# EAGLE board bmsEC2 (EAGLE 4.13)
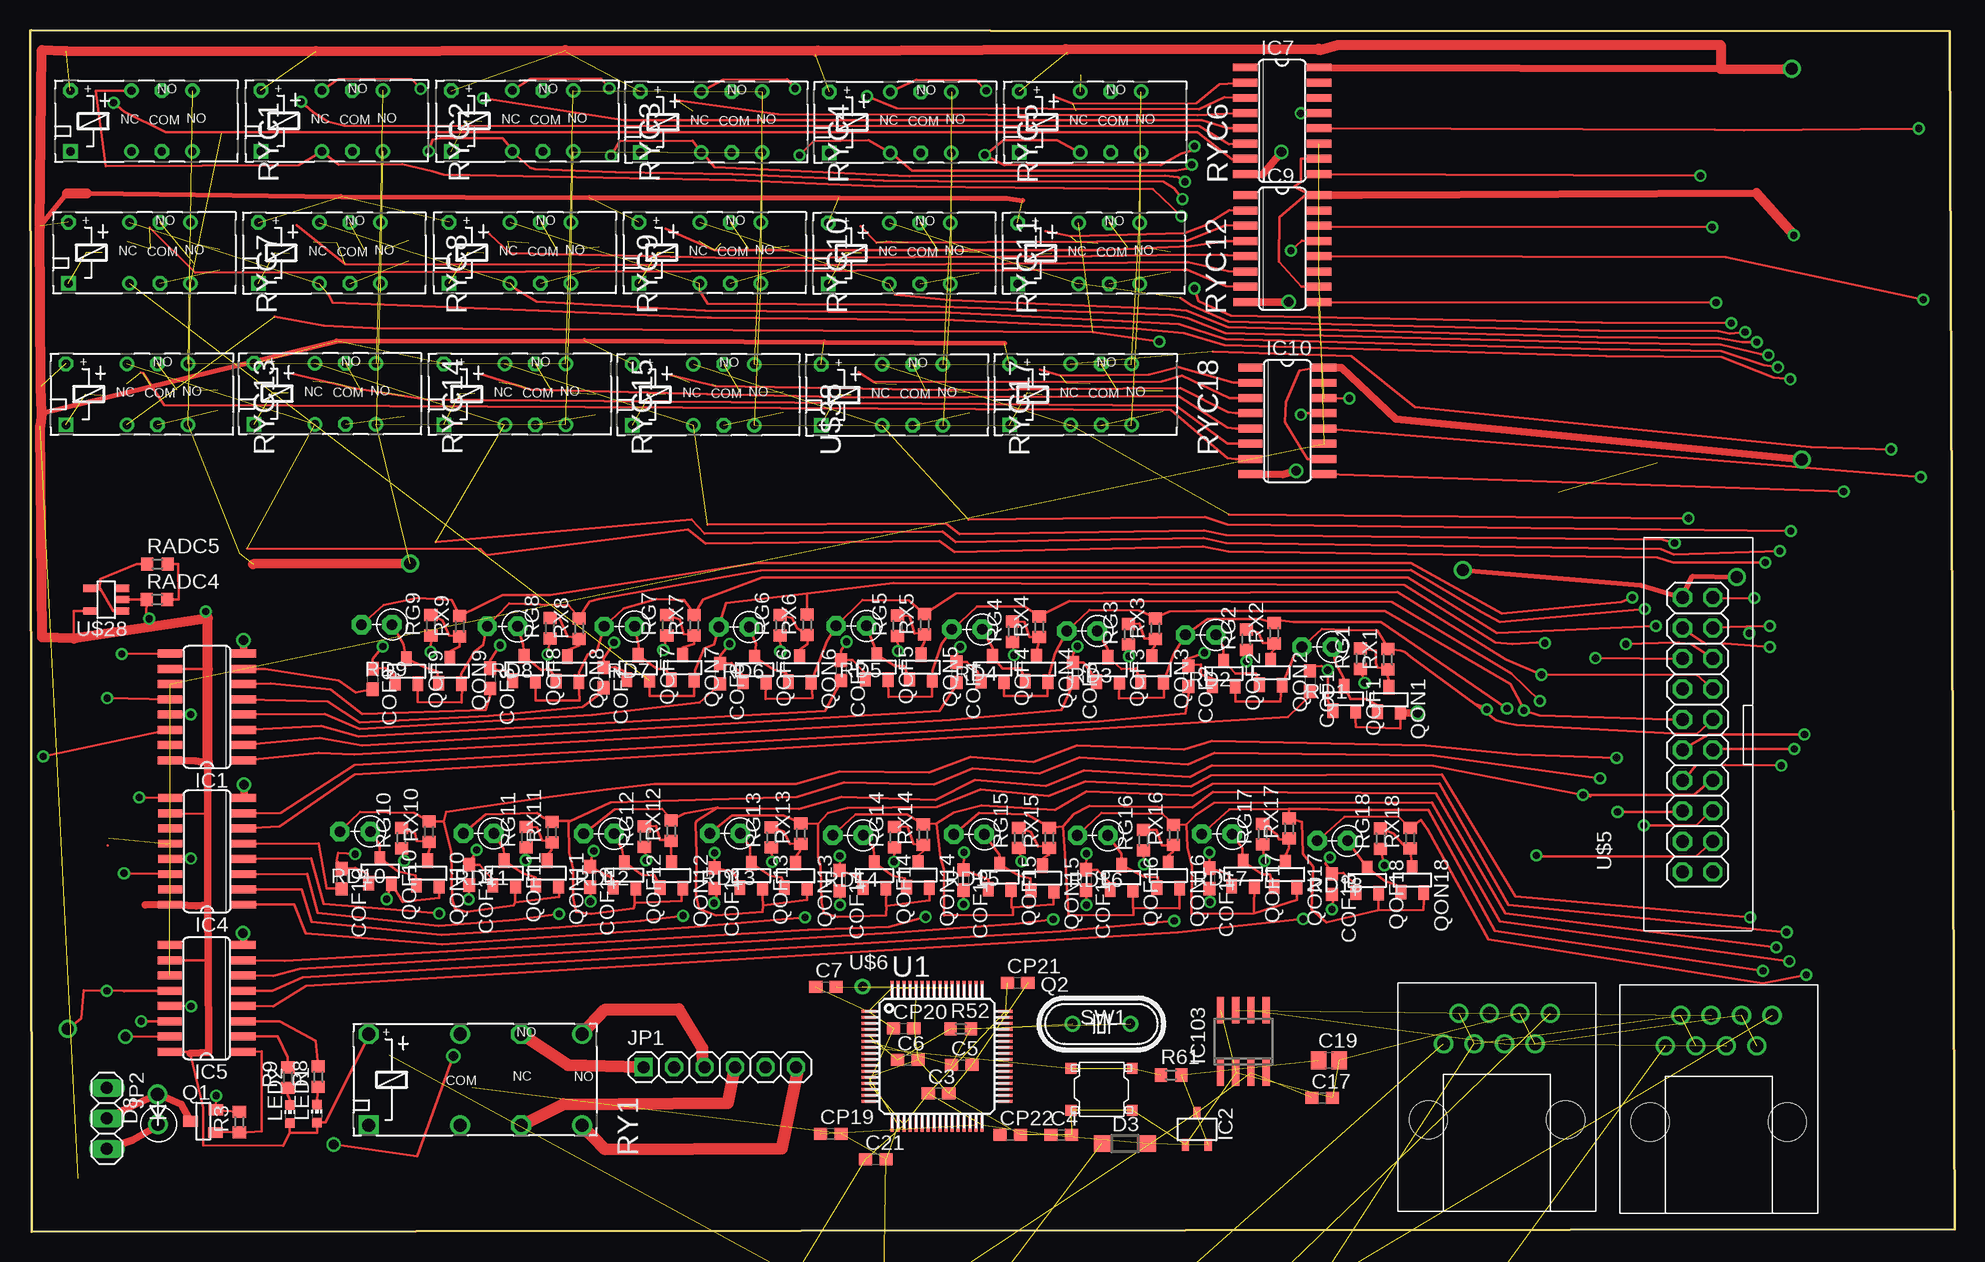
[diagram p2: board, top side]
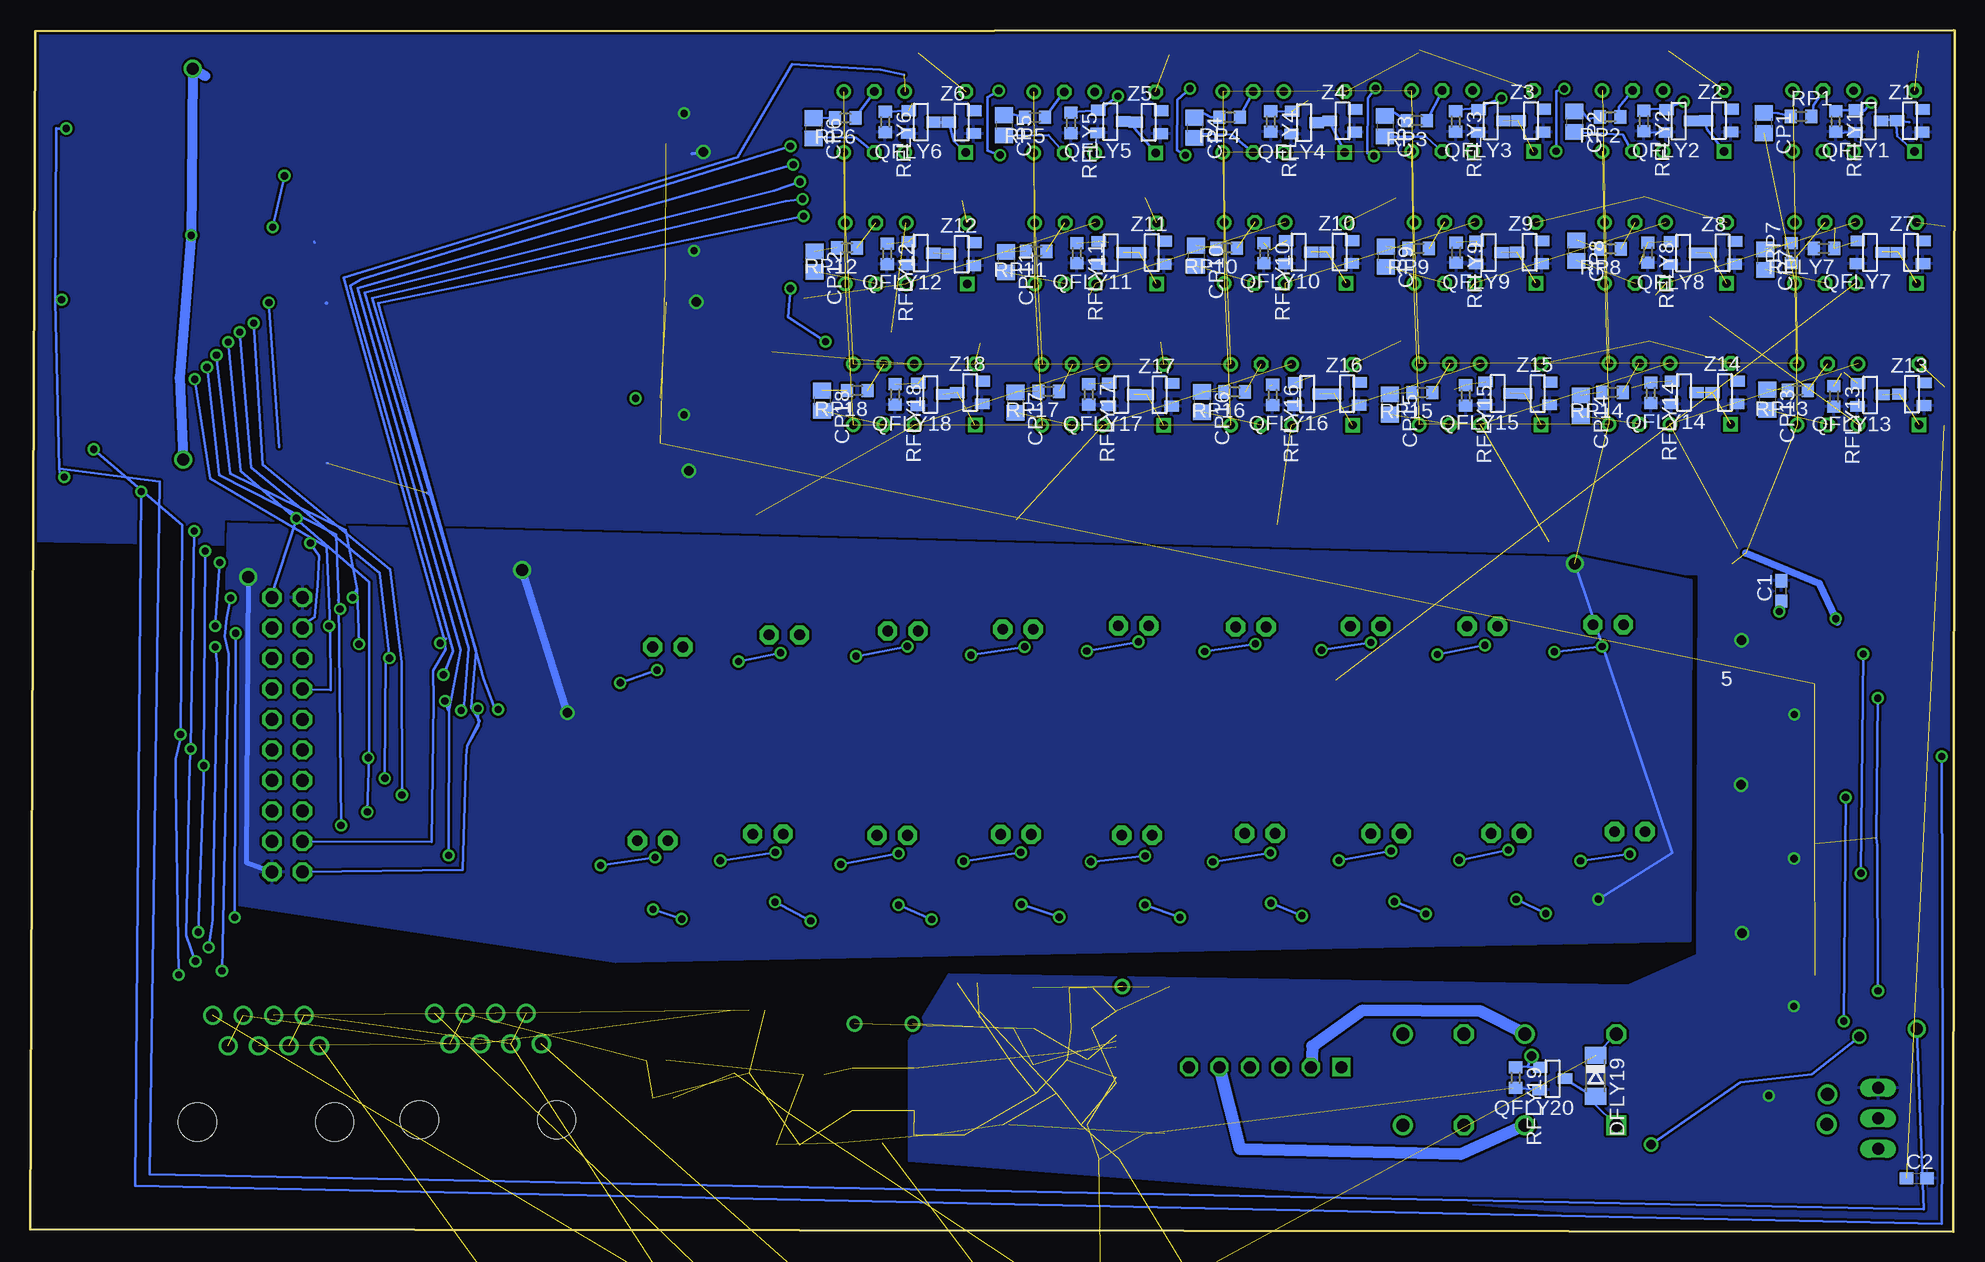
[diagram p3: board, bottom side, seen from below]

Size 160.43 x 100.2 mm. Coordinates in mm from the lower left corner, seen from the top.
Outline: 0,100.15 0.13,0 160.43,0.22 160.01,100.1 0.08,100.2
Copper layers (1*16): Top 0.035mm / dielectric 1.5mm / Bottom 0.035mm
Design rules "default": minimum track width 8mil, minimum drill 0.6mm, track to track 8mil, track to pad 8mil, pad to pad 8mil, via to via 8mil, smd to smd 0mil, copper to edge 8mil, drill to drill 8mil, minimum pad ring 10mil, minimum via ring 8mil, stop-mask expansion 4mil, vias tented up to drill 0mil, thermal gap 10mil

## Footprints (pad centres in the part's own frame; a part is rotated, then mirrored left to right if it is on the bottom)
R0603 = smd 1 x 1.1: 1 -0.85,0; 2 0.85,0
C0603 = smd 1.1 x 1: 1 -0.85,0; 2 0.85,0
ES-2,5L = drill 0.889 pad 1.27 octagon: 1 0,0; 2 2.54,0
C0805 = smd 1.3 x 1.5: 1 -0.85,0; 2 0.85,0
DO41-10_VERT = drill 1.1 round: A 2.58,0.05; C 0.07,0
SOD123 = smd 1.4 x 1.4: A 1.9,0; C -1.9,0
SOD80C = smd 1.4 x 1.8: A 1.7,0; C -1.7,0
SO16 = smd 0.66 x 2.032: 1 -4.445,-3.073; 2 -3.175,-3.073; 3 -1.905,-3.073; 4 -0.635,-3.073; 5 0.635,-3.073; 6 1.905,-3.073; 7 3.175,-3.073; 8 4.445,-3.073; 9 4.445,3.073; 10 3.175,3.073; 11 1.905,3.073; 12 0.635,3.073; 13 -0.635,3.073; 14 -1.905,3.073; 15 -3.175,3.073; 16 -4.445,3.073
SOT-23A = smd 0.6 x 1: P$1 -0.95,-1.35; P$2 0.95,-1.35; P$3 0,1.35
SO-08 = smd 0.6 x 2.2: 1 -1.905,-2.6; 2 -0.635,-2.6; 3 0.635,-2.6; 4 1.905,-2.6; 5 1.905,2.6; 6 0.635,2.6; 7 -0.635,2.6; 8 -1.905,2.6
1X06 = drill 1 square: 1 -6.35,0 | drill 1 octagon: 2 -3.81,0; 3 -1.27,0; 4 1.27,0; 5 3.81,0; 6 6.35,0
1X03 = drill 1 long: 1 -2.54,0; 2 0,0; 3 2.54,0
MOD8P8C = drill 1.067 pad 1.397 round: 1 -3.81,-2.54; 2 -2.54,0; 3 -1.27,-2.54; 4 0,0; 5 1.27,-2.54; 6 2.54,0; 7 3.81,-2.54; 8 5.08,0 | hole 3.175: -5.08,-8.89; 6.35,-8.89
CHIP-LED0603 = smd 0.8 x 0.8: A 0,-0.75; C 0,0.75
CHIPLED_0805 = smd 1.2 x 1.2: A 0,-1.05; C 0,1.05
SOLDPAD035 = drill 0.889 pad 1.27 round: MP 0,0
SOT-23 = smd 0.9 x 1.2: 1 -1,-1.006; 2 0.9,-1.056; 3 -0.05,1.056
HC49/S = drill 0.813 round: 1 -2.413,0; 2 2.413,0
RS-2,5 = drill 0.9 pad 1.6 octagon: 1 0,0; 2 2.54,0
RS-2,5@1 = drill 0.889 pad 1.6 octagon: 1 0,0; 2 2.54,0
J104D = drill 1.1 round: 3 0,6.35; 5 10.16,6.35; 8 10.16,-1.27; 10 0,-1.27 | drill 1.1 octagon: 4 5.08,6.35; 9 5.08,-1.27; + -7.62,6.35 | drill 1.1 square: - -7.62,-1.27
EC2 = drill 0.7 round: 3 -1.27,2.54; 5 3.81,2.54; 8 3.81,-2.54; 10 -1.27,-2.54 | drill 0.7 octagon: 4 1.27,2.54; 9 1.27,-2.54; + -6.35,2.54 | drill 0.7 square: - -6.35,-2.54
E-SWITCH = smd 0.9 x 0.9: P$1 -2.55,1.75; P$2 2.55,1.75; P$3 -2.55,-1.75; P$4 2.55,-1.75
TQFP64 = smd 1.2 x 0.26: 1 -5.7,3.75; 2 -5.7,3.25; 3 -5.7,2.75; 4 -5.7,2.25; 5 -5.7,1.75; 6 -5.7,1.25; 7 -5.7,0.75; 8 -5.7,0.25; 9 -5.7,-0.25; 10 -5.7,-0.75; 11 -5.7,-1.25; 12 -5.7,-1.75; 13 -5.7,-2.25; 14 -5.7,-2.75; 15 -5.7,-3.25; 16 -5.7,-3.75; 33 5.7,-3.75; 34 5.7,-3.25; 35 5.7,-2.75; 36 5.7,-2.25; 37 5.7,-1.75; 38 5.7,-1.25; 39 5.7,-0.75; 40 5.7,-0.25; 41 5.7,0.25; 42 5.7,0.75; 43 5.7,1.25; 44 5.7,1.75; 45 5.7,2.25; 46 5.7,2.75; 47 5.7,3.25; 48 5.7,3.75 | smd 0.26 x 1.2: 17 -3.75,-5.7; 18 -3.25,-5.7; 19 -2.75,-5.7; 20 -2.25,-5.7; 21 -1.75,-5.7; 22 -1.25,-5.7; 23 -0.75,-5.7; 24 -0.25,-5.7; 25 0.25,-5.7; 26 0.75,-5.7; 27 1.25,-5.7; 28 1.75,-5.7; 29 2.25,-5.7; 30 2.75,-5.7; 31 3.25,-5.7; 32 3.75,-5.7; 49 3.75,5.7; 50 3.25,5.7; 51 2.75,5.7; 52 2.25,5.7; 53 1.75,5.7; 54 1.25,5.7; 55 0.75,5.7; 56 0.25,5.7; 57 -0.25,5.7; 58 -0.75,5.7; 59 -1.25,5.7; 60 -1.75,5.7; 61 -2.25,5.7; 62 -2.75,5.7; 63 -3.25,5.7; 64 -3.75,5.7
2X10_KEYED = drill 1.067 octagon: 1 -11.46,-1.27; 2 -11.46,1.27; 3 -8.92,-1.27; 4 -8.92,1.27; 5 -6.38,-1.27; 6 -6.38,1.27; 7 -3.84,-1.27; 8 -3.84,1.27; 9 -1.3,-1.27; 10 -1.3,1.27; 11 1.24,-1.27; 12 1.24,1.27; 13 3.78,-1.27; 14 3.78,1.27; 15 6.32,-1.27; 16 6.32,1.27; 17 8.86,-1.27; 18 8.86,1.27; 19 11.4,-1.27; 20 11.4,1.27
SOLPAD028 = drill 0.8 pad 1.1 round: MP 0,0
SOT23-5 = smd 0.6 x 1.2: 1 -0.95,-1.306; 2 0,-1.306; 3 0.95,-1.306; 4 0.95,1.306; 5 -0.95,1.306
LM2596SW = drill 1 square: 1 0,16.5; 2 0,0; 3 37.5,0; 4 37.5,16.5

## Placement (x,y rotation side)
BEAD  1  [R0603]  0.69,-75.63 0 top  (outside the outline)
C1  0.1u  [C0603]  14.47,53.44 90 bottom
C2  0.1u  [C0603]  3.16,4.47 0 bottom
C3  100n  [C0603]  75.71,11.56 0 top
C4  100n  [C0603]  85.93,8.08 0 top
C5  15p  [C0603]  77.64,13.91 0 top
C6  15p  [C0603]  73.15,14.34 0 top
C7  100n  [C0603]  66.32,20.43 0 top
C8  10@25V  [ES-2,5L]  72.9,-48.82 0 top  (outside the outline)
C9  10@25V  [ES-2,5L]  82.01,-48.8 0 top  (outside the outline)
C10  4.7u  [C0603]  91.8,-45.76 0 top  (outside the outline)
C11  100n  [C0603]  10.8,-75.62 0 top  (outside the outline)
C13  1u  [C0603]  20.92,-75.62 0 top  (outside the outline)
C14  4.7u  [C0603]  31.04,-75.63 0 top  (outside the outline)
C15  100u@5v  [ES-2,5L]  17.92,-60.8 0 top  (outside the outline)
C16  1u  [C0603]  0.69,-81.86 0 top  (outside the outline)
C17  2.2u@16v  [C0603]  107.68,11.17 0 top
C18  100n  [C0603]  10.81,-81.86 0 top  (outside the outline)
C19  4.7u@10v  [C0805]  108.24,14.32 0 top
C21  100n  [C0603]  70.48,6.06 0 top
COF1  0.1u  [C0603]  106.67,45.91 270 top
COF2  0.1u  [C0603]  96.56,46.32 270 top
COF3  0.1u  [C0603]  86.9,46.63 270 top
COF4  0.1u  [C0603]  77.19,46.65 270 top
COF5  0.1u  [C0603]  67.57,46.81 270 top
COF6  0.1u  [C0603]  57.49,46.54 270 top
COF7  0.1u  [C0603]  47.81,46.21 270 top
COF8  0.1u  [C0603]  38.33,46.15 270 top
COF9  0.1u  [C0603]  28.52,46.1 270 top
COF10  0.1u  [C0603]  25.97,29.44 270 top
COF11  0.1u  [C0603]  36.57,29.76 270 top
COF12  0.1u  [C0603]  46.67,29.6 270 top
COF13  0.1u  [C0603]  57.06,29.5 270 top
COF14  0.1u  [C0603]  67.47,29.29 270 top
COF15  0.1u  [C0603]  77.77,29.34 270 top
COF16  0.1u  [C0603]  87.99,29.35 270 top
COF17  0.1u  [C0603]  98.28,29.47 270 top
COF18  0.1u  [C0603]  108.49,29 270 top
CP1  4.7u  [C0805]  15.93,92.45 270 bottom
CP2  4.7u  [C0805]  31.7,92.55 270 bottom
CP3  4.7u  [C0805]  47.5,92.17 270 bottom
CP4  4.7u  [C0805]  63.35,92.04 270 bottom
CP5  4.7u  [C0805]  79.25,92.25 270 bottom
CP6  4.7u  [C0805]  95.12,92 270 bottom
CP7  4.7u  [C0805]  15.79,81.06 270 bottom
CP8  4.7u  [C0805]  31.53,81.81 270 bottom
CP9  4.7u  [C0805]  47.42,81.29 270 bottom
CP10  4.7u  [C0805]  63.23,81.37 270 bottom
CP11  4.7u  [C0805]  79.07,80.84 270 bottom
CP12  4.7u  [C0805]  95.05,80.89 270 bottom
CP13  4.7u  [C0805]  15.63,69.37 270 bottom
CP14  4.7u  [C0805]  31.15,68.88 270 bottom
CP15  4.7u  [C0805]  47.08,68.99 270 bottom
CP16  4.7u  [C0805]  62.73,69.19 270 bottom
CP17  4.7u  [C0805]  78.3,69.15 270 bottom
CP18  4.7u  [C0805]  94.41,69.29 270 bottom
CP19  2.2u  [C0603]  66.72,8.2 0 top
CP20  4.7u  [C0603]  72.8,16.96 0 top
CP21  2.2u  [C0603]  82.3,20.78 0 top
CP22  4.7u  [C0603]  81.69,8.11 0 top
D  1N4004_VERT  [DO41-10_VERT]  44.5,-36.39 0 top  (outside the outline)
D3  1N4448  [SOD123]  91.25,7.37 0 top
D8  1N4004_VERT  [DO41-10_VERT]  10.65,8.9 90 top
DFLY19  [SOD80C]  29.93,13.01 270 bottom
IC1  74LS595D  [SO16]  14.73,43.76 90 top
IC2  MCP1702  [SOT-23A]  97.24,8.6 0 top
IC4  74LS595D  [SO16]  14.74,31.73 90 top
IC5  74LS595D  [SO16]  14.7,19.47 90 top
IC7  74LS595D  [SO16]  104.35,92.63 270 top
IC9  74LS595D  [SO16]  104.36,81.97 270 top
IC10  74LS595D  [SO16]  104.78,67.61 270 top
IC103  MCP2551  [SO-08]  101.12,15.88 0 top
JP1  [1X06]  57.47,13.74 0 top
JP2  [1X03]  6.38,9.46 270 top
JP3  [1X06]  65.77,-36.24 0 top  (outside the outline)
JP7  [MOD8P8C]  121.62,18.23 0 top
JP8  [MOD8P8C]  140.11,18.05 0 top
LED1  [CHIP-LED0603]  23.88,9.88 0 top
LED2  [CHIP-LED0603]  21.65,9.83 0 top
LED3  [CHIPLED_0805]  66.44,-48.43 0 top  (outside the outline)
P11  SOLPAD035  [SOLDPAD035]  98.77,-36.13 0 top  (outside the outline)
P18  SOLPAD035  [SOLDPAD035]  33.25,-48.65 0 top  (outside the outline)
P21  SOLPAD035  [SOLDPAD035]  45.26,-48.65 0 top  (outside the outline)
P28  SOLPAD035  [SOLDPAD035]  57.27,-48.65 0 top  (outside the outline)
Q1  NFET  [SOT-23]  14.42,9.28 90 top
Q2  [HC49/S]  89.28,17.34 0 top
QFLY1  NFET  [SOT-23]  7.2,92.56 270 bottom
QFLY2  NFET  [SOT-23]  23.02,92.56 270 bottom
QFLY3  NFET  [SOT-23]  38.67,92.56 270 bottom
QFLY4  NFET  [SOT-23]  54.23,92.43 270 bottom
QFLY5  NFET  [SOT-23]  70.37,92.52 270 bottom
QFLY6  NFET  [SOT-23]  86.17,92.47 270 bottom
QFLY7  NFET  [SOT-23]  7.07,81.61 270 bottom
QFLY8  NFET  [SOT-23]  22.62,81.56 270 bottom
QFLY9  NFET  [SOT-23]  38.83,81.6 270 bottom
QFLY10  NFET  [SOT-23]  54.7,81.63 270 bottom
QFLY11  NFET  [SOT-23]  70.33,81.58 270 bottom
QFLY12  NFET  [SOT-23]  86.19,81.55 270 bottom
QFLY13  NFET  [SOT-23]  7.05,69.73 270 bottom
QFLY14  NFET  [SOT-23]  22.56,69.93 270 bottom
QFLY15  NFET  [SOT-23]  38.09,69.86 270 bottom
QFLY16  NFET  [SOT-23]  53.97,69.8 270 bottom
QFLY17  NFET  [SOT-23]  69.46,69.76 270 bottom
QFLY18  NFET  [SOT-23]  85.38,69.77 270 bottom
QFLY20  NFET  [SOT-23]  33.53,12.73 270 bottom
QOF1  NFET  [SOT-23]  109.57,44.44 0 top
QOF2  NFET  [SOT-23]  99.53,46.54 0 top
QOF3  NFET  [SOT-23]  89.88,46.86 0 top
QOF4  NFET  [SOT-23]  80.26,46.93 0 top
QOF5  NFET  [SOT-23]  70.61,47.08 0 top
QOF6  NFET  [SOT-23]  60.42,46.87 0 top
QOF7  NFET  [SOT-23]  50.72,47.03 0 top
QOF8  NFET  [SOT-23]  41.21,46.94 0 top
QOF9  NFET  [SOT-23]  31.41,46.74 0 top
QOF10  NFET  [SOT-23]  29.2,30.08 0 top
QOF11  NFET  [SOT-23]  39.56,29.89 0 top
QOF12  NFET  [SOT-23]  49.57,29.73 0 top
QOF13  NFET  [SOT-23]  60.15,29.69 0 top
QOF14  NFET  [SOT-23]  70.41,29.72 0 top
QOF15  NFET  [SOT-23]  80.86,29.59 0 top
QOF16  NFET  [SOT-23]  91.02,29.53 0 top
QOF17  NFET  [SOT-23]  101.15,29.84 0 top
QOF18  NFET  [SOT-23]  111.49,29.29 0 top
QON1  NFET  [SOT-23]  113.3,44.36 0 top
QON2  NFET  [SOT-23]  103.45,46.62 0 top
QON3  NFET  [SOT-23]  93.56,46.88 0 top
QON4  NFET  [SOT-23]  83.93,46.92 0 top
QON5  NFET  [SOT-23]  74.29,47.06 0 top
QON6  NFET  [SOT-23]  64.18,46.88 0 top
QON7  NFET  [SOT-23]  54.43,47.04 0 top
QON8  NFET  [SOT-23]  44.82,46.91 0 top
QON9  NFET  [SOT-23]  35.03,46.76 0 top
QON10  NFET  [SOT-23]  33.18,29.89 0 top
QON11  NFET  [SOT-23]  43.14,29.89 0 top
QON12  NFET  [SOT-23]  53.5,29.72 0 top
QON13  NFET  [SOT-23]  63.85,29.69 0 top
QON14  NFET  [SOT-23]  74.04,29.75 0 top
QON15  NFET  [SOT-23]  84.42,29.48 0 top
QON16  NFET  [SOT-23]  94.91,29.71 0 top
QON17  NFET  [SOT-23]  104.68,29.79 0 top
QON18  NFET  [SOT-23]  115.24,29.33 0 top
R1  1  [RS-2,5]  84.21,-36.13 0 top  (outside the outline)
R2  1K  [R0603]  101.91,-45.76 0 top  (outside the outline)
R3  470K  [R0603]  17.43,9.16 90 top
R8  6.8K  [R0603]  24,12.94 90 top
R9  6.8K  [R0603]  21.48,12.88 90 top
R30  3.3K  [R0603]  20.93,-81.86 0 top  (outside the outline)
R52  1M  [R0603]  77.57,16.93 0 top
R61  10K  [R0603]  95.09,13.08 0 top
RADC4  10K  [R0603]  10.57,52.72 0 top
RADC5  2.7K  [R0603]  10.6,55.67 0 top
RD1  [RS-2,5@1]  108.54,48.76 180 top
RD2  [RS-2,5@1]  98.83,49.77 180 top
RD3  ser-IC7-IC9  [RS-2,5@1]  88.94,50.09 180 top
RD4  [RS-2,5@1]  79.35,50.24 180 top
RD5  [RS-2,5@1]  69.71,50.53 180 top
RD6  [RS-2,5@1]  59.93,50.43 180 top
RD7  [RS-2,5@1]  50.37,50.48 180 top
RD8  [RS-2,5@1]  40.63,50.49 180 top
RD9  [RS-2,5@1]  30.15,50.62 180 top
RD10  [RS-2,5@1]  28.34,33.37 180 top
RD11  [RS-2,5@1]  38.64,33.22 180 top
RD12  [RS-2,5@1]  48.66,33.2 180 top
RD13  [RS-2,5@1]  59.18,33.22 180 top
RD14  [RS-2,5@1]  69.43,33.07 180 top
RD15  [RS-2,5@1]  79.52,33.14 180 top
RD16  [RS-2,5@1]  89.82,33.05 180 top
RD17  [RS-2,5@1]  100.19,33.17 180 top
RD18  [RS-2,5@1]  109.81,32.61 180 top
RFLY1  470K  [R0603]  9.92,92.58 270 bottom
RFLY2  470K  [R0603]  25.91,92.61 270 bottom
RFLY3  470K  [R0603]  41.59,92.56 270 bottom
RFLY4  470K  [R0603]  57.01,92.56 270 bottom
RFLY5  470K  [R0603]  73.66,92.45 270 bottom
RFLY6  470K  [R0603]  89.14,92.53 270 bottom
RFLY7  470K  [R0603]  10.9,81.99 180 bottom
RFLY8  470K  [R0603]  25.57,81.64 270 bottom
RFLY9  470K  [R0603]  41.55,81.64 270 bottom
RFLY10  470K  [R0603]  57.57,81.6 270 bottom
RFLY11  470K  [R0603]  73.17,81.6 270 bottom
RFLY12  470K  [R0603]  88.98,81.55 270 bottom
RFLY13  470K  [R0603]  10.07,69.65 270 bottom
RFLY14  470K  [R0603]  25.33,69.94 270 bottom
RFLY15  470K  [R0603]  40.76,69.73 270 bottom
RFLY16  470K  [R0603]  56.85,69.78 270 bottom
RFLY17  470K  [R0603]  72.18,69.83 270 bottom
RFLY18  470K  [R0603]  88.32,69.81 270 bottom
RFLY19  470K  [R0603]  36.6,12.86 270 bottom
RG1  470K  [R0603]  110.88,47.78 90 top
RG2  470K  [R0603]  101.37,49.38 90 top
RG3  470K  [R0603]  91.55,49.82 90 top
RG4  470K  [R0603]  81.88,50.04 90 top
RG5  470K  [R0603]  72.29,50.53 90 top
RG6  470K  [R0603]  62.5,50.58 90 top
RG7  470K  [R0603]  53.06,50.57 90 top
RG8  470K  [R0603]  43.32,50.34 90 top
RG9  470K  [R0603]  33.4,50.56 90 top
RG10  470K  [R0603]  30.95,32.84 90 top
RG11  470K  [R0603]  41.33,32.91 90 top
RG12  470K  [R0603]  51.19,32.96 90 top
RG13  470K  [R0603]  61.77,32.89 90 top
RG14  470K  [R0603]  72.03,32.91 90 top
RG15  470K  [R0603]  82.4,32.85 90 top
RG16  470K  [R0603]  92.79,32.65 90 top
RG17  470K  [R0603]  102.72,33.17 90 top
RG18  470K  [R0603]  112.55,32.79 90 top
RP1  1K  [R0603]  12.79,93 0 bottom
RP2  1K  [R0603]  28.71,92.95 180 bottom
RP3  1K  [R0603]  44.83,92.64 180 bottom
RP4  1K  [R0603]  60.43,92.93 180 bottom
RP5  1K  [R0603]  76.66,92.92 180 bottom
RP6  1K  [R0603]  92.46,92.86 180 bottom
RP7  1K  [R0603]  13.62,81.6 90 bottom
RP8  1K  [R0603]  28.68,81.95 180 bottom
RP9  1K  [R0603]  44.68,81.99 180 bottom
RP10  1K  [R0603]  60.68,82.02 180 bottom
RP11  1K  [R0603]  76.54,81.75 180 bottom
RP12  1K  [R0603]  92.33,82.04 180 bottom
RP13  1K  [R0603]  13.08,70.16 180 bottom
RP14  1K  [R0603]  28.5,70 180 bottom
RP15  1K  [R0603]  44.37,69.97 180 bottom
RP16  1K  [R0603]  60.01,70.03 180 bottom
RP17  1K  [R0603]  75.53,70.08 180 bottom
RP18  1K  [R0603]  91.47,70.15 180 bottom
RX1  470K  [R0603]  113.16,47.73 90 top
RX2  470K  [R0603]  103.68,49.92 90 top
RX3  470K  [R0603]  93.78,50.3 90 top
RX4  470K  [R0603]  84.11,50.44 90 top
RX5  470K  [R0603]  74.55,50.65 90 top
RX6  470K  [R0603]  64.75,50.62 90 top
RX7  470K  [R0603]  55.34,50.58 90 top
RX8  470K  [R0603]  45.76,50.3 90 top
RX9  470K  [R0603]  35.8,50.48 90 top
RX10  470K  [R0603]  33.24,33.37 90 top
RX11  470K  [R0603]  43.49,33.32 90 top
RX12  470K  [R0603]  53.42,33.44 90 top
RX13  470K  [R0603]  64.23,33.19 90 top
RX14  470K  [R0603]  74.43,33.13 90 top
RX15  470K  [R0603]  84.94,32.85 90 top
RX16  470K  [R0603]  95.3,33.1 90 top
RX17  470K  [R0603]  104.93,33.64 90 top
RX18  470K  [R0603]  115.02,32.83 90 top
RY1  J104D  [J104D]  35.83,10.15 0 top
RYC1  EC2  [EC2]  9.69,92.6 0 top
RYC2  EC2  [EC2]  25.57,92.62 0 top
RYC3  EC2  [EC2]  41.45,92.61 0 top
RYC4  EC2  [EC2]  57.19,92.52 0 top
RYC5  EC2  [EC2]  72.96,92.5 0 top
RYC6  EC2  [EC2]  88.78,92.52 0 top
RYC7  EC2  [EC2]  9.53,81.63 0 top
RYC8  EC2  [EC2]  25.36,81.61 0 top
RYC9  EC2  [EC2]  41.25,81.63 0 top
RYC10  EC2  [EC2]  57.07,81.63 0 top
RYC11  EC2  [EC2]  72.88,81.59 0 top
RYC12  EC2  [EC2]  88.66,81.59 0 top
RYC13  EC2  [EC2]  9.32,69.84 0 top
RYC14  EC2  [EC2]  25.01,69.88 0 top
RYC15  EC2  [EC2]  40.82,69.84 0 top
RYC17  EC2  [EC2]  72.27,69.77 0 top
RYC18  EC2  [EC2]  87.99,69.81 0 top
SW1  E-SWITCH  [E-SWITCH]  89.31,11.9 0 top
U1  STM32F10XRXT6  [TQFP64]  75.59,14.64 0 top
U$5  PINHD-2X10_KEYED  [2X10_KEYED]  138.99,41.48 90 top
U$6  SOLDPAD028  [SOLPAD028]  69.38,20.46 0 top
U$28  MCP6L01  [SOT23-5]  6.33,52.71 90 top
U$30  LM2596SWR  [LM2596SW]  33.34,-24.02 0 top  (outside the outline)
U$38  EC2  [EC2]  56.54,69.8 0 top
Z1  ZDIO-SOT23  [SOT-23]  3.74,92.68 90 bottom
Z2  ZDIO-SOT23  [SOT-23]  19.65,92.7 90 bottom
Z3  ZDIO-SOT23  [SOT-23]  35.3,92.69 90 bottom
Z4  ZDIO-SOT23  [SOT-23]  51.03,92.67 90 bottom
Z5  ZDIO-SOT23  [SOT-23]  67.2,92.56 90 bottom
Z6  ZDIO-SOT23  [SOT-23]  82.78,92.57 90 bottom
Z7  ZDIO-SOT23  [SOT-23]  3.65,81.71 90 bottom
Z8  ZDIO-SOT23  [SOT-23]  19.35,81.67 90 bottom
Z9  ZDIO-SOT23  [SOT-23]  35.43,81.72 90 bottom
Z10  ZDIO-SOT23  [SOT-23]  51.28,81.74 90 bottom
Z11  ZDIO-SOT23  [SOT-23]  66.91,81.69 90 bottom
Z12  ZDIO-SOT23  [SOT-23]  82.78,81.56 90 bottom
Z13  ZDIO-SOT23  [SOT-23]  3.56,69.89 90 bottom
Z14  ZDIO-SOT23  [SOT-23]  19.14,70.03 90 bottom
Z15  ZDIO-SOT23  [SOT-23]  34.76,69.95 90 bottom
Z16  ZDIO-SOT23  [SOT-23]  50.65,69.92 90 bottom
Z17  ZDIO-SOT23  [SOT-23]  66.28,69.84 90 bottom
Z18  ZDIO-SOT23  [SOT-23]  82.07,70.03 90 bottom

## Tracks (layer width: path | path; a pad name or v marks a point on that pad's centre or on a via)
+5V  (via drill 0.6, 1)  (26 unrouted)
  Top 0.203: 21.63,8.25 LED2.A | 21.63,8.25 23.9,8.27 23.94,9.14 | 23.94,9.14 LED1.A | IC5.16 13.29,15.03 13.33,14.88 14.41,10.33 14.41,7.24 21.07,7.17 21.64,8.27 21.63,8.25 | 23.94,9.14 24.64,9.12 28.29,16.5 RY1.+ | U$28.5 3.64,51.77 3.64,49.29 3.65,49.46 | 14.8,46.91 14.75,46.91 IC1.10 | 14.81,34.83 14.87,34.83 IC4.10 | 14.83,22.65 14.89,22.65 IC5.10 | IC7.10 105.91,89.47 105.93,87.5 105.33,87.15 106.43,86.61 | IC9.16 107.28,86.2 106.43,86.61 | IC10.10 106.45,64.41 104.59,67.52 104.66,69.16 105.78,71.8 107.18,72.04 107.99,72.14 IC10.16 | IC9.10 105.95,78.8 104.09,80.87 104.11,84.6 106.38,86.51 106.43,86.61
  Top 0.406: 4.71,86.58 25.91,86.31 46.59,86.23 67.43,86.22 78.4,86.17 81.4,86.17 82.71,85.98 | 0.8,83.77 3.04,86.59 0.79,83.83 | 0.95,68.25 25.52,74.28 46.18,74.32 66.17,74.18 81.21,74.08 | 107.4,98.64 107.6,98.64 | 23.82,98.44 23.82,98.47 | 44.61,98.52 44.72,98.31 | 65.63,98.48 65.45,98.14 | 86.32,98.6 86.43,98.31
  Top 0.61: 140.91,96.96 IC7.16 | 107.4,98.64 107.4,98.53 | IC9.16 110.96,86.44 143.89,86.61 | IC10.16 109.31,72.05 113.84,67.75 v147.66,64.39 | IC1.16 13.81,39.27 14.81,39.1 14.81,34.83 14.81,27.25 | 13.33,14.88 14.86,14.99 14.83,22.65 14.81,27.25 | 9.58,27.28 11.98,27.31 IC4.16 13.85,27.2 14.81,27.25
  Top 0.813: 3.04,86.59 4.71,86.58 | 0.8,83.77 0.87,70.48 0.95,68.25 0.85,67.21 | 0.79,83.83 0.96,98.54 2.84,98.47 3.01,98.47 23.82,98.44 44.61,98.52 65.63,98.48 86.32,98.6 107.4,98.64 | 107.4,98.53 109.01,98.97 140.91,98.97 140.91,96.96 146.99,96.93 v146.85,96.99 | v146.99,83.08 143.89,86.61 | 0.82,67.16 0.99,49.56 3.65,49.46 14.8,51.14 | 14.81,39.1 14.81,39.2 14.8,46.91 14.8,51.14 | 14.8,51.14 v14.63,51.71
  Bottom 0.203: DFLY19.C 29.88,14.81 RY1.+
  Bottom 0.406: 146.95,86.91 146.96,86.91 146.96,87.23
  Bottom 0.813: 146.99,83.27 146.95,86.91 v146.85,96.99 146.84,96.96 145.8,96.35 | 146.99,83.27 147.96,71.21 v147.66,64.39 | 146.99,83.27 147,83.27 v146.99,83.08 | C1.1 14.46,52.47 v14.63,51.71
+12V  (3 unrouted)
+12V_RESISTORED  (1 unrouted)
AGND  (via drill 0.6, 0.8, 1)  (19 unrouted)
  Top 0.203: QON1.2 114.19,41.97 110.48,42.09 110.41,43.33 QOF1.2 | QON10.2 34.09,27.83 31.04,27.5 30.1,29.11 | 30.1,29.11 QOF10.2 | U$28.2 RADC4.1 9.67,51.36 v9.92,51.12 | v29.71,27.74 30.1,29.11
  Top 0.406: v119.4,55.19 134.22,53.92 U$5.20 137.67,52.79 138.55,54.67 v142.23,54.61
  Top 0.61: QON1.2 114.18,43.28 v115.64,43.28
  Top 0.813: v31.65,55.73 18.57,55.66
  Bottom 0.203: 9.93,51.13 9.96,51.12 v9.92,51.12 | v29.71,27.74 23.52,31.61 v31.65,55.73
  Bottom 0.406: U$5.1 142.39,30.8 v142.23,54.61
  Bottom 0.61: v115.64,43.28 v119.4,55.19 | 9.79,50.83 9.93,51.13 11.27,54.05 17.43,56.58
  pour Bottom (rank 2): 143.92,59.05 144.76,27.51 111.6,22.52 22.02,24.26 21.96,54.34 30.91,56.16
C1  (via drill 0.6)
  Top 0.203: 120.43,43.99 115.08,47.93 114.57,48.36 114.22,48.49 RX1.2 113.22,48.62 112.28,50.13 109.81,50.2 107.65,50.25 RD1.2 105.32,48.05 105.04,47.25 QON2.2 104.29,45.56 104.2,44.22 100.44,44.22 QOF2.2 | 120.43,43.99 122.21,42.62 122.98,42.44 123.87,42.25 136.9,41.54 138.92,41.51 140.25,42.74 U$5.11 | v95.94,84.69 93.57,86.95 86.17,87.03 73.89,87.15 70.39,87.2 58.81,87.69 34.45,88.12 33.51,88.42 31,89 25.72,88.99 RYC2.10 24.08,89.93 22.37,88.93 6.29,88.86 5.47,95.14 RYC1.3 | 120.43,43.99 120.92,43.84 v121.41,43.56
  Bottom 0.203: v95.94,84.69 131.41,77.43 122.63,46.11 121.65,43.57 v121.41,43.56
C2  (via drill 0.6)
  Top 0.203: v96.04,86.11 95.35,87.03 94.44,87.54 75.66,87.58 71.14,87.62 58.54,88.16 48.8,88.35 42.1,88.6 41.66,88.74 RYC3.10 40.25,90.12 39.36,91.17 34.17,91.17 33.52,91.07 v33.22,90.09 | v123.1,43.65 112.58,50.85 105.27,50.83 104.3,50.98 103.78,50.7 RX2.2 103.74,50.73 102.54,51.1 98.11,51.09 RD2.2 96.27,49.76 95.31,48.12 QON3.2 94.44,45.85 94.49,44.57 90.75,44.49 QOF3.2 | v32.55,95.29 31.81,96.11 25.68,96.11 24.27,95.14 RYC2.3
  Bottom 0.203: 124,40.53 122.97,42.59 123.68,43.71 123.25,48.45 131.92,77.86 97.44,85.92 v96.04,86.11 | 124,40.53 124.06,39.62 124.35,30.19 137.83,30.01 U$5.2 | 124,40.53 123.03,42.21 v123.1,43.65 | v33.22,90.09 33.2,95.09 v32.55,95.29
C3  (via drill 0.6)
  Top 0.203: v96.25,87.54 95.66,87.94 94.6,88.04 73.28,88.02 57.02,88.77 55.98,90.02 RYC4.10 55.97,89.99 55.19,90.96 49.11,90.94 v48.41,89.7 | U$5.12 137.9,42.74 136.54,42.74 125.79,43.07 v124.5,43.47 124.24,44.05 123.39,45.7 112.9,51.77 97.22,51.77 94.95,51.74 93.76,51.2 RX3.2 93.86,51.19 92.41,51.82 88.3,51.83 RD3.2 85.43,48.23 84.8,45.93 QON4.2 84.81,45.82 84.81,44.67 81.15,44.67 QOF4.2 | RYC3.3 41.71,96.12 47.6,96.13 v48.27,95.35
  Bottom 0.203: v124.5,43.47 124.27,43.4 123.87,48.67 132.54,78.31 98.43,86.8 v96.25,87.54 | v48.27,95.35 48.9,94.51 48.95,89.93 v48.41,89.7
C4  (via drill 0.6)
  Top 0.203: v96.81,88.97 96.36,88.64 95.5,88.49 73.51,88.48 71.77,89.93 RYC5.10 71.75,89.94 69.87,91 65.3,90.94 v64.12,89.77 | v125.53,31.38 125.78,31.31 137.1,31.32 138.82,31.3 140.28,32.59 U$5.3 | v125.84,44.27 123.46,46.54 113.49,52.51 86.63,52.58 84.14,51.34 RX4.2 84.16,51.29 82.87,52.15 78.91,52.12 76.87,50.23 RD4.2 76.91,50.32 75.97,49.03 75.22,46.79 QON5.2 75.17,46.1 75.17,44.65 71.54,44.6 QOF5.2 | RYC4.3 57.75,96.07 63.1,96.09 v63.74,95.32
  Bottom 0.203: 125.49,43.53 v125.53,31.38 | 125.49,43.53 124.53,48.53 133.11,78.67 v96.81,88.97 | 125.49,43.53 125.59,43.53 v125.84,44.27 | v63.74,95.32 64.78,94.39 64.81,90.17 v64.12,89.77
C5  (via drill 0.6)
  Top 0.203: U$5.13 140.33,45.19 138.87,46.48 136.96,46.48 v125.97,46.45 126.11,46.39 123.01,47.71 113.94,53.36 77.15,53.23 RX5.2 74.58,51.49 73.24,52.62 69.39,52.67 RD5.2 67.21,50.51 66.41,49.28 QON6.2 65.14,45.8 65.22,44.53 61.27,44.45 QOF6.2 | v97.05,90.51 96.9,90.2 95.92,89.87 94.19,88.93 86.72,88.96 81.19,88.93 79.6,89.78 v79.56,89.78 79.59,89.76 81.12,91.03 85.58,91.03 RYC6.10 | RYC5.3 73.87,96.04 78.85,96.03 v79.68,95.14
  Bottom 0.203: v125.97,46.45 125.15,48.45 133.75,78.87 132.8,79.41 v97.05,90.51 | v79.68,95.14 80.61,94.61 80.62,90.15 v79.56,89.78
C6  (via drill 0.6)  (2 unrouted)
  Top 0.203: RD6.2 57.46,50.41 | RD6.2 57.98,52.44 64.76,53.24 | 64.76,53.24 71.95,54.08 114.55,53.95 122.14,49.14 123.54,49.02 125.58,49.12 v126.25,49.08 | 64.76,53.24 RX6.2 | RD6.2 57.43,50.43 56.99,48.97 56.18,48.63 55.4,46.82 QON7.2 55.37,45.98 55.32,44.69 51.61,44.69 QOF7.2
  Bottom 0.203: U$5.4 126.96,32.51 126.8,44.26 126.84,46.79 125.79,48.56 125.79,48.58 | 125.92,49.44 125.79,48.58 | 125.92,49.44 134.29,79.57 101.45,89.6 96.91,97.35 89.55,96.88 87.56,96.49 | 125.79,48.58 125.81,48.58 | 125.92,49.44 125.76,49.46 v126.25,49.08
C7  (via drill 0.6)  (2 unrouted)
  Top 0.203: v146.71,71.08 145.32,71.23 141,72.92 131.38,73 99.54,73.94 96.16,74.93 92.18,75.3 76.99,76.01 56.75,76.22 56.47,76.24 42.38,76.81 25.19,77.46 24.89,78.13 | v135.51,50.52 122.24,49.94 114.84,54.57 61.01,54.55 56.07,52.74 RX7.2 55.4,51.44 54.51,52.69 52.2,52.76 49.47,51.98 RD7.2 47.24,48.48 46.44,48.12 45.76,46.64 QON8.2 45.72,45.83 45.79,44.31 42.11,44.29 42.13,45.88 QOF8.2
  Bottom 0.203: v146.71,71.08 145.42,62.82 135.7,57.11 135.42,50.52 | 135.42,50.52 135.35,45.18 137.66,45.22 U$5.14 | 135.42,50.52 135.6,50.52 v135.51,50.52
C8  (via drill 0.6)  (2 unrouted)
  Top 0.203: v145.68,72.08 144.5,72.26 140.94,73.44 130.78,73.58 99.63,74.44 95.75,75.66 91.05,75.94 76.72,76.62 56.26,76.81 42.2,77.55 40.43,78.63 | v134.51,33.9 138.88,33.9 140.35,35.3 U$5.5 | v134.59,51.93 122.48,50.86 120.95,51.7 115.07,55.17 60.87,55.14 47.42,52.76 46.61,52.55 45.76,51.23 RX8.2 45.85,51.15 44.88,52.23 42.51,52.32 39.93,52.37 RD8.2 38.08,50.55 37.75,48.93 37.02,48.38 35.91,46.53 QON9.2 36.01,45.59 35.97,44.15 32.3,44.17 QOF9.2
  Bottom 0.203: 134.71,52.69 134.9,58.14 144.68,63.08 v145.68,72.08 | 134.71,52.69 v134.51,33.9 | 134.71,52.69 134.74,52.69 v134.59,51.93
C9  (via drill 0.6)  (2 unrouted)
  Top 0.203: v144.89,73.1 144.25,73.19 140.91,73.99 130.66,74.12 99.64,74.92 96.44,76.17 95.15,76.42 71.32,77.32 56.47,77.39 55.8,78.48 | v133.01,49 137.06,49.13 138.41,49 140.31,47.8 U$5.15 | v133.53,52.88 132.62,52.53 122.66,51.54 115.1,55.75 60.53,55.78 43.34,53.09 39.38,53.08 35.78,51.33 RX9.2 35.83,51.31 35.12,52.67 32.29,52.85 29.44,52.27 RD9.2
  Bottom 0.203: 133.16,53.58 134.13,58.51 143.73,63.23 v144.89,73.1 | 133.16,53.58 v133.01,49 | 133.16,53.58 133.2,53.58 v133.53,52.88
C10  (via drill 0.6)  (2 unrouted)
  Top 0.203: v143.91,74.17 142.69,74.16 140.76,74.53 130.62,74.6 99.83,75.41 96.38,76.82 95,76.95 76.65,77.66 72.08,78.12 | U$5.6 137.76,35.02 v132.31,35.02 | RD10.2 27.49,35 32.01,34.94 RX10.2 34.45,34.22 | v132.23,39.53 123.91,39.82 116.32,40.56 98.48,40.95 96.17,40.22 87.24,40.54 83.62,39.19 78.36,39.61 74.92,38.32 67.46,38.38 63.82,37.33 52.03,37.33 48.1,36.89 42.64,36.16 34.65,35.03 34.45,34.17 34.45,34.22 | QON11.2 44.07,27.91 40.43,27.48 | QOF11.2 40.43,27.48 | 34.45,34.22 34.47,34.22 35.09,31.77 35.16,27.76 35.4,26.95 36.36,26.69 40.31,27.23 40.43,27.48
  Bottom 0.203: v143.91,74.17 142.86,63.42 132.18,54.19 132.16,39.54 | 132.16,39.54 v132.31,35.02 | 132.16,39.54 132.55,39.55 v132.23,39.53
C11  (via drill 0.6)  (2 unrouted)
  Top 0.203: v142.94,75.01 141.65,74.9 140.72,75.1 130.75,75.15 99.87,75.89 96.83,77.21 95.89,77.84 | U$5.16 137.87,47.77 v130.47,47.83 | v130.85,37.82 116.96,39.72 98.69,39.92 96.49,38.97 87.46,39.57 84.11,38.21 78.52,38.64 75.35,37.3 67.83,37.46 63.93,36.25 48.38,35.81 44.96,34.22 44.89,34.12 | QON12.2 54.33,28.57 54.31,27.6 50.42,27.42 | 50.42,27.42 50.39,27.42 50.39,28.72 QOF12.2 | 44.89,34.12 44.9,31.58 45.26,30.3 45.23,27.87 45.5,26.68 46.75,26.53 50.27,26.97 50.42,27.42 | 44.89,34.12 45.01,34.25 43.91,34.26 RX11.2 42.81,34.57 42.8,34.52 42.25,34.92 37.97,34.82 RD11.2
  Bottom 0.203: v142.94,75.01 141.98,63.73 131.3,54.92 v130.47,47.83 130.77,47.83 v130.85,37.82
C12  (via drill 0.6)  (2 unrouted)
  Top 0.203: v97.05,78.66 97.36,77.59 100.07,76.38 131.01,75.79 v141.79,75.76 | U$5.7 140.21,37.71 138.67,36.41 v129.43,36.43 130.06,36.31 116.96,38.85 98.48,38.9 96.65,37.94 87.84,38.48 84.65,37.19 78.73,37.66 75.46,36 67.62,36.27 64.09,35.28 57.24,35.34 | 20.39,76.31 24.46,75.55 28.54,75.36 88.6,75 v94.11,74.21 | QON13.2 64.74,27.66 61.09,27.24 | 61.09,27.24 61.03,27.93 61.01,28.65 QOF13.2 | 61.09,27.24 61.02,26.67 57.15,26.38 55.76,26.91 55.51,28.04 55.52,31.46 55.45,34.07 55.56,34.28 57.24,35.34 | RD12.2 48.7,35.22 52.67,35.25 53.52,34.3 RX12.2 54.54,34.9 57.27,35.37 57.24,35.34
  Bottom 0.203: v129.43,36.43 129.47,47.46 130.42,55.21 141.05,63.99 v141.79,75.76 | v97.05,78.66 97.26,76.25 v94.11,74.21
C13  (via drill 0.6)  (2 unrouted)
  Top 0.203: 18.09,56.98 37.53,56.91 38.04,56.44 54.82,58.55 56.27,57.39 75.79,57.61 77.03,56.7 97.76,57.14 99.87,56.74 135.62,56.23 136.95,55.79 v144.63,55.8 | U$5.17 140.3,50.37 143.08,50.46 | v144.99,50.52 143.08,50.46 | v143.36,26.23 123.78,27.96 117.66,38.13 98.43,38.05 96.76,37.13 87.94,37.55 84.86,36.35 79.22,36.87 75.59,35.43 68.14,35.34 66.5,34.92 65.65,34.03 | QON14.2 74.94,27.65 71.36,27.17 | 71.36,27.17 71.32,27.17 71.37,28.72 QOF14.2 | 65.65,34.03 RX13.2 64.27,34.06 62.78,34.72 58.5,34.72 RD13.2 | 65.65,34.03 65.68,31.25 65.89,30.47 65.96,27.49 66.16,26.57 67.27,26.27 71.35,26.37 71.36,27.17 | 143.08,50.46 v143.28,49.91
  Bottom 0.203: v144.63,55.8 v144.99,50.52 | v143.28,49.91 v143.36,26.23 | U$5.17 140.28,50.26
C14  (via drill 0.6)  (2 unrouted)
  Top 0.203: 33.78,57.51 55.12,59.39 56.22,58.24 76.05,58.39 77.14,57.5 97.77,57.85 99.66,57.44 135.9,56.91 137,56.46 v145.82,56.77 | v145.96,38.87 141.27,38.93 138.84,38.9 137.8,37.6 U$5.8 | v146.4,24.99 123.21,27.26 117.47,37.38 98.56,37.35 96.89,36.37 88.02,36.74 85.41,35.19 79.31,35.54 76.98,34.98 75.56,34.05 75.54,34.05 | QON15.2 85.3,27.32 81.93,27.06 | 81.93,27.06 81.8,27.06 81.82,28.57 QOF15.2 | 75.54,34.05 RX14.2 74.54,33.94 73.09,34.82 68.77,34.79 RD14.2 | 75.54,34.05 75.88,31.2 76.18,30.24 76.16,26.39 81.93,26.42 81.93,27.06
  Bottom 0.203: v145.82,56.77 v145.96,38.87 145.97,37.73 v146.4,24.99
C15  (via drill 0.6)  (2 unrouted)
  Top 0.203: 56.47,58.99 76.35,59.06 77.45,58.18 97.84,58.48 99.67,58.11 136.04,57.72 v137.06,57.42 | v145.55,23.72 122.96,26.56 117.15,36.55 98.59,36.68 96.87,35.39 88.3,35.51 87,34.86 86.1,33.8 86.08,33.8 | v144.99,48.76 141.25,49.04 139.66,49.02 137.6,50.38 U$5.18 | QON16.2 95.79,26.97 91.97,27.01 | 91.97,27.01 91.9,27.01 QOF16.2 | 86.08,33.8 RX15.2 85,33.74 83.09,34.81 79.1,34.91 RD15.2 | 86.08,33.8 86.26,31.47 86.54,26.38 91.95,26.42 91.97,27.01
  Bottom 0.203: v137.06,57.42 136.33,56.33 136.44,53.91 136.71,51.26 137.95,50.44 U$5.18 | v145.55,23.72 145.21,26 144.84,47.33 v144.99,48.76
C16  (via drill 0.6)  (2 unrouted)
  Top 0.203: 78.21,59.4 97.92,59.6 99.8,58.99 v146.74,58.42 | U$5.9 140.45,40.25 v147.04,40.26 | v146.64,22.57 122.48,25.88 116.85,35.81 98.65,35.76 97.16,34.75 96.37,33.97 96.39,33.97 | 96.39,33.97 RX16.2 95.33,33.99 94.37,34.86 89.28,34.93 RD16.2 | 96.39,33.97 96.44,32.05 96.83,30.49 96.78,26.51 102,26.55 | 102,26.55 105.6,27.68 105.63,28.65 QON17.2 | 102,26.55 102.01,27.01 QOF17.2
  Bottom 0.203: v146.74,58.42 v147.04,40.26 147.12,39.07 147.42,24.74 v146.64,22.57
C17  (via drill 0.6)  (2 unrouted)
  Top 0.203: v138.22,59.49 99.92,59.81 | 108.85,35.18 108.81,35.18 | 108.85,35.18 116.53,35.18 122.08,25.08 v144.43,21.76 | U$5.19 140.33,52.79 v143.7,52.84 | QOF18.2 112.38,26.83 112.31,26.81 | 112.31,26.81 116.11,26.83 116.19,28.35 QON18.2 | RD17.2 99.96,35.21 104.92,35.26 | 104.92,35.26 107.49,35.28 108.85,35.19 108.85,35.18 | 112.31,26.81 108.05,25.82 106.78,26.88 106.96,30.42 106.09,31.52 106,34.17 RX17.2 104.94,34.47 104.92,35.26
  Bottom 0.203: U$5.19 140.39,52.74 v138.22,59.49 | v144.43,21.76 143.86,48.16 144.22,49.63 144.02,51.16 v143.7,52.84
C18  (via drill 0.6)  (1 unrouted)
  Top 0.203: v148.03,21.42 144.42,20.71 121.56,24.38 116.48,33.52 115.92,34.35 RX18.2 115.09,33.64 114.05,34.63 109.56,34.59 RD18.2 | 98.59,73.4 110.11,73.02 115.42,68.78 148.4,65.45 v155.11,65.24 | v147.89,41.48 139.93,41.49 137.81,40.28 137.7,40.19 U$5.10
  Bottom 0.203: 147.86,41.2 148.27,39.41 148.27,37.41 v148.03,21.42 | 147.86,41.2 147.74,58.94 v155.11,65.24 | 147.86,41.2 148,41.43 v147.89,41.48
CAN_RAW_PLUS  (4 unrouted)
CANCABLE_1_1  (1 unrouted)
CANCABLE_1_8  (1 unrouted)
CANCABLE_2_1  (1 unrouted)
CANCABLE_2_8  (1 unrouted)
FLYCAP-COMMON  (17 unrouted)
FLYCAP-OPAMP-OUT
  Top 0.203: RADC5.2 12.35,55.66 12.38,52.72 RADC4.2
GND  (via drill 0.6, 0.8)  (39 unrouted)
  Top 0.203: R3.2 15.53,10.14 Q1.2 v15.5,11.36 | IC5.13 v13.4,18.81 | IC4.13 v13.39,31.12 | IC1.13 v13.37,43.15 | v105.07,81.8 105.98,82.62 IC9.13 | v104.88,77.53 104.76,77.45 | v104.29,90.03 104.25,90.05 | IC10.13 106.19,68.28 v105.92,68.12 | v105.53,63.46 105.43,63.4 | v105.9,93.25 IC7.13
  Top 0.61: IC1.8 v17.76,49.33 | IC4.8 v17.8,37.29 | IC5.8 v17.73,24.9 | IC10.8 104.42,63.13 v105.53,63.46 | IC9.8 v104.88,77.53 | IC7.8 102.71,88.14 v104.29,90.03
  Bottom 0.203: RFLY1.2 10.19,91.58 QFLY1.2 | RFLY19.2 36.83,12 QFLY20.2 | v17.76,49.33 17.69,49.49 | v17.8,37.29 17.84,37.29 | v17.73,24.9 17.88,24.98 | 126.88,61.27 127.36,61.64 | v15.5,11.36 15.45,11.39 | v13.39,31.12 13.58,31.07 | v13.37,43.15 13.32,43.15 | 135.61,64.08 135.69,64.1 | 136.76,82.54 136.69,82.49 | v105.9,93.25 105.78,93.28 | QFLY2.2 25.32,91.65 25.9,91.85 RFLY2.2
  Bottom 0.305: 135.74,77.44 135.69,77.44 | v104.29,90.03 105.24,89.88
  pour Bottom (rank 3): -2.26,101.06 161.37,101.33 162.83,57.64 30.92,55.12 21.33,54.81 21.47,23.08 27.17,20.55 83.84,21.48 87.15,15.91 87.15,5.95 -0.28,-0.83 -1.45,1.6
LED_BUS_PWR  (1 unrouted)
MCP2551_CANH  (2 unrouted)
MCP2551_CANL  (2 unrouted)
N$2  (via drill 0.6)
  Top 0.203: IC7.6 99.9,90.68 97.45,92.19 26.15,92.24 24.83,92.54 23.57,93.35 v22.57,94.22
  Bottom 0.203: QFLY2.1 24.13,93.63 | 24.13,93.63 v22.57,94.22 | 24.13,93.63 25.33,93.59 25.86,93.37 RFLY2.1
N$3
  Bottom 0.203: RYC2.4 28.01,93.77 28.05,92.71 RP2.1
N$4
  Top 0.203: D8.A 10.5,11.54 | JP2.2 6.19,9.44
  Top 0.61: Q1.3 12.6,10.64 10.5,11.54 | 6.19,9.44 D8.A
N$5
  Top 0.203: 10.77,8.91 D8.C
  Top 0.61: JP2.3 8.5,7.65 10.77,8.91
N$6  (via drill 0.8)
  Top 0.203: v7.95,16.28 IC5.15 | v25.29,7.3 32.24,6.29 v35.26,14.65
  Bottom 0.203: RFLY19.1 36.6,13.82 35.56,13.78 | 35.56,13.78 QFLY20.1 | v7.95,16.28 11.92,13.13 17.87,12.49 v25.29,7.3 | 35.56,13.78 35.56,13.81 v35.26,14.65
N$7
  Top 0.203: R9.1 21.47,11.43 21.76,10.77 LED2.C
N$8  (1 unrouted)
N$9
  Bottom 0.203: CP2.2 27.65,91.46 26.88,90.03 RYC2.9
N$10
  Top 0.203: R8.1 23.96,11.45 23.86,10.87 LED1.C
N$11  (via drill 0.6)
  Top 0.203: IC7.5 99.85,92 97.68,92.66 49.51,92.7 v37.77,94.51
  Bottom 0.203: QFLY3.1 39.9,93.67 | 39.9,93.67 v37.77,94.51 | RFLY3.1 41.85,93.5 39.9,93.67
N$12  (via drill 0.6)
  Top 0.203: IC7.7 100.15,89.44 97.3,91.67 11.29,91.69 7.82,93.4 v6.94,94.14
  Bottom 0.203: QFLY1.1 9.58,93.5 RFLY1.1 9.45,93.52 7.53,93.52 7.53,93.47 v6.94,94.14
N$13  (1 unrouted)
  Top 0.203: 100.41,93.26 97.29,93.1 62.32,93.2 53.86,94.33
  Top 0.406: 100.41,93.26 IC7.4
  Bottom 0.203: RFLY4.1 57.02,93.39 QFLY4.1
N$14  (via drill 0.6)
  Top 0.203: IC7.3 99.53,94.59 97.41,93.59 72.2,93.69 v69.75,94.69
  Bottom 0.203: 73.68,93.3 RFLY5.1 73.61,93.34 QFLY5.1 71.35,93.53 v69.75,94.69
N$16  (1 unrouted)
  Top 0.203: IC7.2 99.13,95.69 97.21,94.09 86.9,94.05 85.36,94.65
  Bottom 0.203: RFLY6.1 89.11,93.4 QFLY6.1
N$17
  Top 0.203: U$28.4 5.84,53.62 | 5.84,53.62 6.93,51.78 7.72,51.74 U$28.1 | RADC5.1 8.86,55.66 5.83,54.45 5.8,53.56 5.84,53.62
N$18
  Top 0.203: IC1.1 24.03,39.94 26.99,39.79 76.7,42.7 85.96,43.5 86.96,45.77 COF3.2
N$19  (2 unrouted)
  Top 0.203: IC9.6 99.82,80.09 96.49,80.83 66.24,80.6 26.24,80.7 22.19,83.93
N$20
  Top 0.203: IC1.2 24.14,41.17 27.66,40.56 75.77,43.44 77.24,45.7 COF4.2
N$21
  Top 0.203: IC1.3 24.23,42.17 27.38,41.29 66.25,43.44 67.45,45.7 COF5.2
N$22  (2 unrouted)
  Top 0.203: 84.61,83.43 86.7,83.03 96.21,83.28 97.88,83.9 99.95,85.18 IC9.2
N$23  (2 unrouted)
  Top 0.203: 9.22,71.64 9.41,71.61 11.15,68.92 21.84,68.89 95.1,68.5 99.77,64.52 100.47,64.44 101.62,64.44 | 101.62,64.44 IC10.7 | 101.62,64.44 101.62,64.42
N$24  (2 unrouted)
  Top 0.203: 21.62,71.61 26.91,70.34 33.08,69.38 42.54,69.29 95.48,68.89 99.79,65.72 100.47,65.7 IC10.6 | IC10.6 | IC10.6 101.7,65.67
N$25  (2 unrouted)
  Top 0.203: 37.43,71.54 41.71,70.21 56.43,69.83 69.47,69.55 95.72,69.7 99.81,67.04 100.47,66.97 IC10.5 | IC10.5 | IC10.5 101.7,67.03
N$26  (2 unrouted)
  Top 0.203: 53.38,71.41 57.11,70.53 76.76,70.2 95.88,70.35 99.85,68.33 100.47,68.25 IC10.4 | IC10.4 | IC10.4
N$27  (2 unrouted)
  Top 0.203: 69.02,71.69 70.33,70.86 94.28,70.87 96,71.38 99.96,69.51 100.47,69.52 101.76,69.52 | 101.76,69.52 IC10.3 | 101.76,69.52 101.76,69.51
N$28  (2 unrouted)
  Top 0.203: 84.16,71.9 85.89,71.37 93.26,71.49 95.71,72.1 100.29,70.81 101.6,70.78 | 101.6,70.78 IC10.2 | 101.6,70.78 101.6,70.74
N$29
  Bottom 0.203: RP3.1 RYC3.4
N$30
  Bottom 0.203: RYC4.9 60.29,91.46 63.31,91.54 CP4.2
N$31
  Bottom 0.203: RYC1.4 11.77,93.87 11.76,92.64 RP1.2
N$32
  Top 0.203: IC1.4 24.53,43.2 27.46,41.91 46.85,43.1 55.8,44.13 57.6,45.73 COF6.2
N$33
  Bottom 0.203: RP2.2 30.57,92.81 31.05,93.39 31.82,93.39 CP2.1
N$34
  Bottom 0.203: RYC3.9 44.07,91.3 47.54,91.3 CP3.2
N$35
  Bottom 0.203: RYC5.9 75.53,91.41 79.36,91.38 CP5.2
N$36
  Bottom 0.203: RYC6.9 91.56,91.21 94.42,91.26 95.12,91.12 CP6.2
N$38  (1 unrouted)
N$39  (1 unrouted)
N$40  (1 unrouted)
N$41  (1 unrouted)
N$42  (1 unrouted)
N$43  (1 unrouted)
N$44  (1 unrouted)
N$45  (1 unrouted)
N$46  (1 unrouted)
N$47  (1 unrouted)
N$48  (1 unrouted)
N$49
  Bottom 0.203: RP4.1 59.6,92.93 RYC4.4
N$50
  Bottom 0.203: RP5.1 75.93,92.81 RYC5.4
N$51
  Bottom 0.203: RP6.1 91.62,92.94 RYC6.4
N$52  (1 unrouted)
N$53  (1 unrouted)
N$54  (1 unrouted)
N$55  (1 unrouted)
N$56  (1 unrouted)
N$57  (1 unrouted)
N$58  (1 unrouted)
N$59  (1 unrouted)
N$60  (1 unrouted)
N$62  (1 unrouted)
N$63  (1 unrouted)
N$64
  Bottom 1.016: RY1.3 39.55,18.4 49.35,18.47 53.54,15.48 53.61,13.68 JP1.2
N$65
  Top 1.016: RY1.4 44.82,13.91 51.03,13.75 JP1.1
N$66
  Top 0.203: IC1.5 24.79,44.22 27.46,42.49 38.21,43 46.04,43.77 47.91,45.19 COF7.2
N$67
  Top 0.203: IC1.6 20.06,45.71 25.02,45.22 27.65,43.2 37.94,43.53 38.47,45.12 COF8.2
N$68
  Top 0.203: IC1.7 19.57,46.93 25.72,45.99 27.13,44.96 28.61,45.25 COF9.2
N$69  (via drill 0.6)
  Top 0.203: v111.23,45.78 RG1.1 | COF1.1 106.68,47.13 107.63,47.16 v108.15,46.83 108.18,46.83 108.18,44.26 QOF1.1
  Bottom 0.203: v108.15,46.83 v111.23,45.78
N$70
  Top 0.203: RD1.1 108.78,47.44 109.51,46.12 109.6,45.45 QOF1.3 110.04,44.45 111.36,44.45 112.25,43.94 112.26,43.35 QON1.1
N$71
  Top 0.203: RG1.2 112.15,48.46 112.15,47.41 112.29,47.04 113.22,46.91 RX1.1 113.13,46.39 113.23,46.03 QON1.3
N$72
  Top 0.203: RG2.2 102.37,49.96 102.75,49.11 103.64,49.1 RX2.1 103.74,48.59 103.49,48.34 QON2.3
N$73
  Top 0.203: QON3.3 93.52,48.03 93.56,48.59 93.76,48.83 RX3.1 93.8,49.49 92.86,49.48 92.44,50.71 RG3.2
N$74  (via drill 0.6)
  Top 0.203: v101.38,47.56 RG2.1 | v97.87,48.28 96.56,47.81 96.53,47.27 COF2.1 96.63,47.28 97.58,47.31 97.6,46.47 98.53,46.14 QOF2.1
  Bottom 0.203: v97.87,48.28 v101.38,47.56
N$75
  Top 0.203: RD2.1 99.47,48.76 99.49,47.62 QOF2.3 100.44,46.54 102.18,46.54 102.47,45.64 QON2.1
N$77
  Top 0.203: QON4.3 83.9,48.2 83.91,48.59 84.06,49.01 RX4.1 84.16,49.58 83.27,49.58 82.88,50.86 RG4.2
N$78
  Top 0.203: QON5.3 74.29,48.18 74.28,48.72 74.55,49.17 RX5.1 74.55,49.91 73.69,49.88 73.27,51.36 RG5.2
N$79
  Top 0.203: RG6.2 63.48,51.2 63.92,50.33 64.78,49.72 | 64.78,49.72 RX6.1 | 64.78,49.72 64.78,49.02 64.16,48.56 64.16,47.85 QON6.3
N$80  (via drill 0.6)
  Top 0.203: v91.58,47.99 RG3.1 | QOF3.1 88.32,46.75 87.78,47.49 COF3.1 86.92,48.14 87.25,48.8 v87.3,48.82
  Bottom 0.203: v87.3,48.82 v91.58,47.99
N$81
  Top 0.203: RD3.1 89.82,48.56 89.79,47.91 QOF3.3 90.96,46.94 92.16,46.99 QON3.1
N$82
  Top 0.203: RG7.2 54.15,51.05 54.47,49.85 55.37,49.73 RX7.1 55.29,49.75 55.32,49.02 54.39,48.71 QON7.3
N$83
  Top 0.203: QON8.3 44.81,48 44.82,48.5 45.74,48.88 RX8.1 45.84,49.53 44.81,49.63 44.12,51.15 RG8.2
N$84
  Top 0.203: QON9.3 35.01,47.84 35.05,48.41 35.8,48.8 RX9.1 35.71,49.65 34.91,49.72 34.38,50.96 RG9.2
N$85
  Top 0.203: RG10.2 32.08,33.21 32.19,32.59 33.29,32.57 RX10.1 33.27,31.92 33.15,31.57 33.16,30.98 QON10.3
N$86  (via drill 0.6)
  Top 0.203: v81.99,48.08 RG4.1 | v77.52,48.78 77.26,48.16 77.26,47.56 COF4.1 | QOF4.1 78.96,46.74 78.1,47.5 COF4.1 | COF4.1 77.16,47.5
  Bottom 0.203: v77.52,48.78 v81.99,48.08
N$87
  Top 0.203: 79.36,50.31 RD4.1 80.25,48.63 80.22,47.9 QOF4.3 81.06,46.99 82.55,46.99 83,45.88 QON4.1
N$88  (via drill 0.6)
  Top 0.203: v72.34,48.42 RG5.1 | v68.04,49.2 67.6,48.47 67.61,47.77 COF5.1 67.53,47.69 68.52,47.67 69.45,46.73 QOF5.1
  Bottom 0.203: v68.04,49.2 v72.34,48.42
N$89
  Top 0.203: RD5.1 70.57,48.23 QOF5.3 72.1,47.17 72.84,47.17 73.24,46.14 QON5.1
N$90
  Top 0.203: QON11.3 43.12,31.45 43.46,31.85 RX11.1 43.51,32.51 42.68,32.62 42.26,33.71 RG11.2
N$91
  Top 0.203: QON12.3 53.45,30.98 53.41,31.97 RX12.1 53.45,32.68 52.5,32.7 52.18,33.83 RG12.2
N$92
  Top 0.203: RG13.2 62.8,33.39 63.33,32.35 64.27,32.44 RX13.1 64.18,31.75 63.86,31.34 63.86,30.81 QON13.3
N$93
  Top 0.203: RG14.2 73.12,33.82 73.64,32.35 74.5,32.3 RX14.1 74.43,31.73 74.02,31.38 74.1,30.86 QON14.3
N$94
  Top 0.203: RG15.2 83.41,33.34 83.98,32.12 84.91,32.17 RX15.1 84.9,31.43 84.9,31.48 84.45,31.2 84.38,30.58 QON15.3
N$95
  Top 0.203: RG16.2 93.86,33.5 94.34,32.24 95.34,32.22 RX16.1 95.26,31.66 94.88,31.38 94.72,30.78 QON16.3
N$96
  Top 0.203: QON17.3 104.69,30.88 104.66,31.43 104.92,32.03 RX17.1 104.94,32.74 104.1,32.74 103.91,33.15 RG17.2
N$97
  Top 0.203: RG18.2 113.64,33.23 114.68,32.03 RX18.1 115.05,31.96 115.12,30.99 115.27,30.51 QON18.3
N$98
  Top 0.203: IC4.7 20.89,34.92 27.02,38.92 89.02,42.54 96.31,43.21 96.6,45.03 COF2.2
N$99
  Top 0.203: IC4.6 20.77,33.79 27.03,38.12 104.84,42.92 106.79,44.81 COF1.2
N$100
  Top 0.203: IC4.5 24.02,32.4 24.69,28.62 26.06,28.62 COF10.2
N$101  (via drill 0.6)
  Top 0.203: IC4.4 23.41,31.15 24.46,27.34 v34.07,26.54 | COF11.2 36.57,28.82 v36.55,27.73
  Bottom 0.203: v34.07,26.54 v36.55,27.73
N$102  (via drill 0.6)
  Top 0.203: IC4.3 23.1,29.83 23.96,26.6 34.05,25.52 40.45,26 v44.07,26.51 | COF12.2 46.7,28.73 v46.69,27.54
  Bottom 0.203: v44.07,26.51 v46.69,27.54
N$103  (via drill 0.6)
  Top 0.203: IC4.2 22.62,28.55 23.44,25.83 34.29,24.76 44.14,25.37 50.89,25.95 v54.42,26.36 | v57,27.41 57.19,28.03 57.06,28.58 COF13.2
  Bottom 0.203: v54.42,26.36 v57,27.41
N$105  (1 unrouted)
N$106
  Bottom 0.203: RP1.1 14.76,93.27 CP1.1
N$107
  Bottom 0.203: RP3.2 46.7,93.3 47.83,93.22 CP3.1
N$108  (1 unrouted)
N$109
  Bottom 0.203: RP4.2 61.98,92.95 62.52,93.24 63.35,93.29 CP4.1
N$110
  Bottom 0.203: RP5.2 78.35,93.15 79.25,93.12 CP5.1
N$111
  Bottom 0.203: CP6.1 95.03,92.9 RP6.2
N$112  (1 unrouted)
N$113  (1 unrouted)
N$114  (1 unrouted)
N$115  (1 unrouted)
N$116  (1 unrouted)
N$117  (1 unrouted)
N$118  (1 unrouted)
N$119  (1 unrouted)
N$120  (1 unrouted)
N$121  (1 unrouted)
N$122  (via drill 0.6)
  Top 0.203: IC4.1 21.98,27.32 22.96,24.88 34.34,23.98 54.89,25.4 v64.57,26.22 | COF14.2 67.52,28.39 v67.5,27.27
  Bottom 0.203: v64.57,26.22 v67.5,27.27
N$123  (via drill 0.6)
  Top 0.203: IC5.7 21.21,22.58 34.73,23.37 64.84,25.19 71.6,25.42 v74.64,26.25 | COF15.2 77.78,28.34 v77.78,27.31
  Bottom 0.203: v74.64,26.25 v77.78,27.31
N$124  (via drill 0.6)
  Top 0.203: IC5.6 20.25,21.36 22.47,21.94 71.73,24.94 82.13,25.7 v85.27,26.06 | COF16.2 88.03,28.45 v88.03,27.25
  Bottom 0.203: v85.27,26.06 v88.03,27.25
N$125  (via drill 0.6)
  Top 0.203: IC5.5 20.17,20.08 22.7,21.22 85.87,25.05 v95.35,25.94 | COF17.2 98.32,28.45 v98.32,27.5
  Bottom 0.203: v95.35,25.94 v98.32,27.5
N$126  (via drill 0.6)
  Top 0.203: v62.52,48.38 RG6.1 | v58.29,49.03 57.5,48.01 57.51,47.46 COF6.1 58.47,47.41 59.29,46.5 59.33,45.93 QOF6.1
  Bottom 0.203: v58.29,49.03 v62.52,48.38
N$127
  Top 0.203: RD6.1 60.49,49.02 60.36,47.98 QOF6.3 61.97,46.89 62.98,46.6 63.22,45.85 QON6.1
N$128  (via drill 0.6)
  Top 0.203: IC5.4 20.23,18.82 22.99,20.5 95.66,24.99 v106.1,26.08 | COF18.2 108.62,28.03 v108.49,26.88
  Bottom 0.203: v106.1,26.08 v108.49,26.88
N$129
  Top 0.203: IC5.3 20.78,17.55 23.8,15.93 23.98,13.85 R8.2
N$130
  Top 0.203: IC5.2 20.61,16.3 21.44,14.55 21.47,13.53 R9.2
N$131  (via drill 0.6)
  Top 0.203: v139.22,88.04 IC7.9 | IC9.14 107.47,83.8 v140.19,83.77
  Bottom 0.203: v140.19,83.77 v139.22,88.04
N$132  (via drill 0.6)
  Top 0.203: v52.77,48.5 RG7.1 | v48.65,49.13 47.78,47.81 47.81,47.13 COF7.1 48.73,47.08 49.61,46.69 49.61,46.06 QOF7.1
  Bottom 0.203: v48.65,49.13 v52.77,48.5
N$133
  Top 0.203: RD7.1 50.7,48.94 50.72,48.09 QOF7.3 52.26,46.94 52.96,46.94 53.4,46.12 QON7.1
N$134
  Top 1.016: RY1.5 47.93,18.54 54.05,18.56 56.01,15.32 56.05,13.73 JP1.3
N$135
  Top 1.016: RY1.9 44.43,10.64 58.15,10.76 58.75,13.71 JP1.4
N$136
  Bottom 1.016: RY1.10 41.18,6.48 59.55,6.89 61.28,13.82 JP1.5
N$137
  Top 1.016: RY1.8 47.9,6.89 62.66,6.96 64.02,13.68 JP1.6
N$138  (via drill 0.6)
  Top 0.203: v43.11,48.15 RG8.1 | v39.17,48.91 38.35,47.62 38.35,46.94 | COF8.1 38.35,46.94 | 38.35,46.94 39.81,46.72 QOF8.1
  Bottom 0.203: v39.17,48.91 v43.11,48.15
N$139
  Top 0.203: QON8.1 43.91,45.93 43.28,46.91 42.58,46.86 QOF8.3 41.15,47.96 41.08,48.99 RD8.1
N$144  (via drill 0.6)
  Top 0.203: v33.37,48.36 RG9.1 | v29.39,48.8 28.52,47.77 28.5,46.93 COF9.1 29.59,47 30.33,46.41 30.29,45.85 QOF9.1
  Bottom 0.203: v29.39,48.8 v33.37,48.36
N$145
  Top 0.203: RD9.1 31.12,48.97 31.29,47.87 QOF9.3 32.93,47.05 33.97,46.74 34.01,45.77 QON9.1
N$150  (via drill 0.6)
  Top 0.203: QOF10.1 28.15,29.14 28.12,29.83 27.08,30.34 COF10.1 25.56,30.98 25.67,31.6 v27.08,31.5 | v31.18,30.93 RG10.1
  Bottom 0.203: v27.08,31.5 v31.18,30.93
N$151
  Top 0.203: RD10.1 29.12,32.3 29.07,31.18 QOF10.3 30.67,30.05 32.11,29.73 32.2,28.98 QON10.1
N$154  (via drill 0.6)
  Top 0.203: v41.3,30.99 RG11.1 | v37.21,31.85 36.56,30.58 COF11.1 37.47,30.58 38.48,29.41 38.46,28.88 QOF11.1
  Bottom 0.203: v37.21,31.85 v41.3,30.99
N$155
  Top 0.203: RD11.1 39.45,31.95 39.53,30.94 QOF11.3 41.08,29.89 42.12,29.54 42.1,28.93 QON11.1
N$158  (via drill 0.6)
  Top 0.203: v51.33,30.96 RG12.1 | v46.97,31.76 46.65,30.67 COF12.1 48.5,29.52 48.57,28.8 QOF12.1
  Bottom 0.203: v46.97,31.76 v51.33,30.96
N$159
  Top 0.203: RD12.1 49.33,31.89 49.51,30.88 QOF12.3 50.98,29.75 52.05,29.71 52.45,28.79 QON12.1
N$162  (via drill 0.6)
  Top 0.203: v61.84,30.85 RG13.1 | v57.04,31.59 57.04,30.42 COF13.1 58.63,30.01 59.16,28.81 QOF13.1
  Bottom 0.203: v57.04,31.59 v61.84,30.85
N$163
  Top 0.203: RD13.1 59.99,32.08 60.01,30.76 QOF13.3 61.7,29.66 62.64,29.56 62.89,28.83 QON13.1
N$174  (via drill 0.6)
  Top 0.203: v72.01,30.86 RG14.1 | COF14.1 67.45,30.12 | 67.45,30.12 v67.48,31.34 | 67.45,30.12 69.07,29.61 69.41,28.74 QOF14.1
  Bottom 0.203: v67.48,31.34 v72.01,30.86
N$175
  Top 0.203: RD14.1 70.31,32.01 70.38,30.83 QOF14.3 71.9,29.7 72.93,29.48 73.09,28.8 QON14.1
N$179  (via drill 0.6)
  Top 0.203: v82.62,30.9 RG15.1 | COF15.1 77.81,30.17 | 77.81,30.17 v77.84,31.64 | 77.81,30.17 79.88,29.38 79.88,28.65 QOF15.1
  Bottom 0.203: v77.84,31.64 v82.62,30.9
N$180
  Top 0.203: RD15.1 80.81,31.43 QOF15.3 82.47,29.66 83.38,29.47 83.43,28.53 QON15.1
N$184  (via drill 0.6)
  Top 0.203: v92.85,30.63 RG16.1 | v88.03,31.54 88.01,30.24 COF16.1 88.94,30.16 89.93,29.18 90,28.6 QOF16.1
  Bottom 0.203: v88.03,31.54 v92.85,30.63
N$185
  Top 0.203: RD16.1 90.94,31.5 91.01,30.58 QOF16.3 92.78,29.64 94,29.57 93.95,28.62 QON16.1
N$189  (via drill 0.6)
  Top 0.203: v102.89,30.95 RG17.1 | v98.3,31.64 98.28,30.39 COF17.1 99.85,29.89 100.13,28.92 QOF17.1
  Bottom 0.203: v98.3,31.64 v102.89,30.95
N$190
  Top 0.203: RD17.1 101.02,31.98 101.09,30.88 QOF17.3 102.7,29.8 103.33,29.79 103.63,28.8 QON17.1
N$194  (via drill 0.6)
  Top 0.203: v112.88,30.55 RG18.1 | v108.32,31.22 107.97,30.74 108.55,29.89 COF18.1 109.45,29.93 110.49,28.95 110.55,28.34 QOF18.1
  Bottom 0.203: v108.32,31.22 v112.88,30.55
N$195
  Top 0.203: RD18.1 111.47,30.35 QOF18.3 112.9,29.27 113.83,28.95 114.33,28.26 QON18.1
N$204  (2 unrouted)
  Top 0.203: IC9.3 99.65,83.92 96.46,82.62 88.93,82.54 70.55,82.46 69.21,83.83
N$205  (2 unrouted)
  Top 0.203: IC9.5 99.81,81.42 96.63,81.49 88.44,81.36 59.02,81.19 39.98,81.61 38.3,83.18
N$206  (2 unrouted)
  Top 0.203: IC9.4 99.6,82.58 96.75,82.2 89.18,81.83 57.04,81.85 52.97,83.63
N$208  (2 unrouted)
  Top 0.203: IC9.7 99.66,78.85 96.4,80.21 13.73,79.99 9.94,83.71
NRST  (3 unrouted)
NSS-RCLK  (via drill 0.6, 1)  (2 unrouted)
  Top 0.203: IC7.12 140.42,91.87 142.88,91.83 142.84,91.86 v157.41,91.99 | IC9.12 141.32,81.25 v157.8,77.71 | v157.57,62.93 IC10.12 | IC4.12 11.65,32.39 | 4.47,20.13 4.24,17.8 3.15,16.94 v3.14,16.91 | 4.47,20.13 7.77,20.08 | 7.77,20.08 7.84,20.08 | 7.84,20.08 IC5.12 | 7.84,20.08 7.84,20.05 7.77,20.08 | 4.47,20.13 7.73,20.08 | 4.47,20.13 v6.39,20.09 | v6.41,44.5 IC1.12 | 6.46,32.23 6.47,32.24
  Bottom 0.203: 157.98,63.63 149.63,62.54 150.46,4.82 2.59,1.89 v3.14,16.91 | 157.98,63.63 158.34,77.63 | 158.34,77.63 158.23,91.99 | 158.23,91.99 158.23,92.03 | 158.23,91.99 158.19,91.99 v157.41,91.99 | 158.34,77.63 158.29,77.63 v157.8,77.71 | 157.98,63.63 157.97,63.3 v157.57,62.93 | v6.39,20.09 6.46,32.23 6.52,32.83 v6.41,44.5
PC8-FETGATE-CHGR-RELAY
  Top 0.203: IC5.1 19.3,15.07 19.28,8.39 17.51,8.27 R3.1 15.53,8.33 Q1.1
PD0_OSC_IN_XTAL  (3 unrouted)
PD1_OSC_OUT  (3 unrouted)
PD2-SDIO_CMD  (1 unrouted)
QDFLY1
  Bottom 0.203: Z1.3 3.78,92.5 | QFLY1.3 5.5,92.73 Z1.3 | RYC1.- 4.8,91.36 4.89,92.71 Z1.3
QDFLY2
  Bottom 0.203: QFLY2.3 21.08,92.77 Z2.3 20.81,92.63 20.68,91.93 RYC2.-
QDFLY3  (2 unrouted)
QDFLY4
  Bottom 0.203: QFLY4.3 53.1,92.45 Z4.3 52.1,92.6 RYC4.-
QDFLY5
  Bottom 0.203: RYC5.- 68.36,92 Z5.3 69.28,92.56 QFLY5.3
QDFLY6
  Bottom 0.203: QFLY6.3 85.02,92.51 Z6.3 83.88,92.54 83.43,90.91 RYC6.-
QDFLY7  (2 unrouted)
QDFLY8  (2 unrouted)
QDFLY9  (2 unrouted)
QDFLY10  (2 unrouted)
QDFLY11  (2 unrouted)
QDFLY12  (1 unrouted)
QDFLY13  (2 unrouted)
QDFLY14  (2 unrouted)
QDFLY15  (2 unrouted)
QDFLY16  (2 unrouted)
QDFLY17  (2 unrouted)
QDFLY18  (2 unrouted)
QDFLY19
  Bottom 0.203: RY1.- 30.06,10.73 30.08,11.49 DFLY19.A 29.92,11.13 QFLY20.3
RYC16  (1 unrouted)
SCK  (5 unrouted)
SER-IC1-IC4  (via drill 0.6)
  Top 0.203: v7.63,48.18 IC1.9 | IC4.14 11.71,29.86 v7.81,29.9
  Bottom 0.203: v7.81,29.9 v7.63,48.18
SER-IC4-IC5  (via drill 0.6)
  Top 0.203: v9.09,36.21 IC4.9 | IC5.14 11.72,17.57 v9.24,17.57
  Bottom 0.203: v9.24,17.57 v9.09,36.21
SER-IC9-IC10  (via drill 0.6)  (1 unrouted)
  Top 0.203: IC10.14 v109.95,69.49 | IC9.9 107.37,77.51 v140.52,77.47
  Bottom 0.203: v140.52,77.47 139.64,65.45
SER-IC10-IC1  (via drill 0.6)
  Top 0.203: v151.15,61.72 IC10.9 | 11.49,41.92 IC1.14 11.44,41.84 v1.08,39.65
  Bottom 0.203: v151.15,61.72 151.67,3.83 1.06,0.68 1,13.87 v1.08,39.65
VBAT1  (3 unrouted)
VBAT-DIODE-RES  (1 unrouted)
VCC  (17 unrouted)
VDDA1  (1 unrouted)
VSS_1-VCAP_1  (1 unrouted)
VSS_3  (1 unrouted)

## Text on the board
bNames: 5
tValues: 3.3V | DIGITAL | +5V | 3.2v | ANALOG | 3.2